# EAGLE schematic lfsensor (EAGLE 6.2)
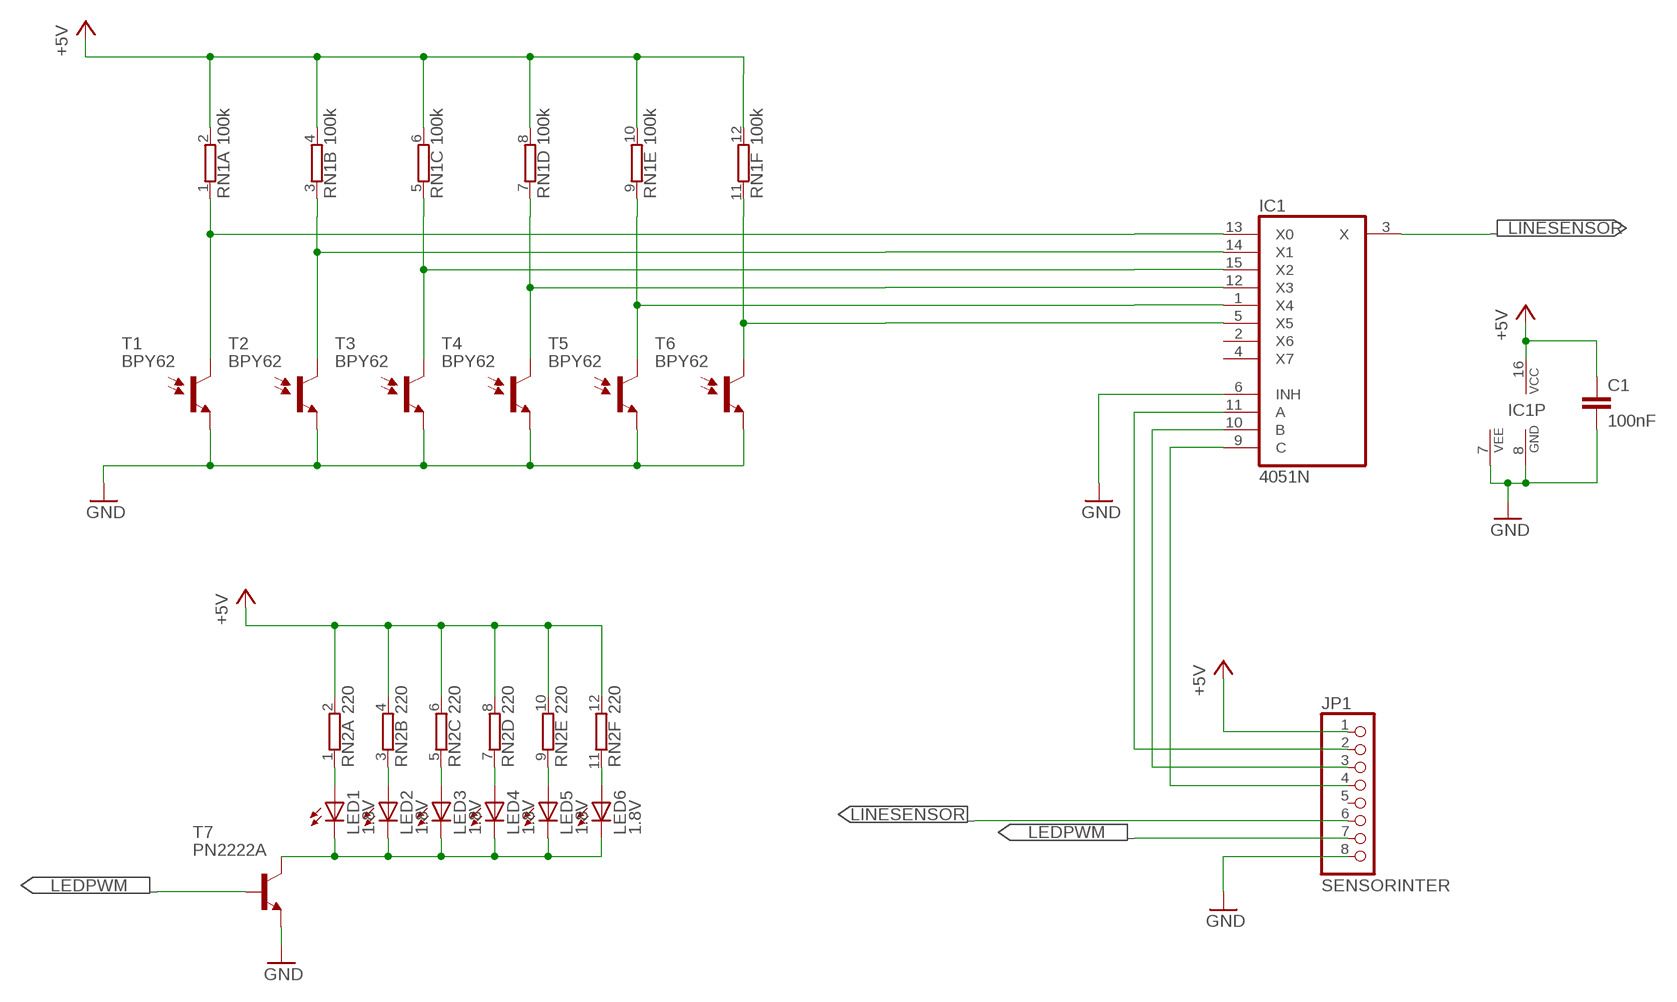
[diagram p0: schematic, sheet 1]

## Parts
C1  100nF  C-EU050-024X044  [C050-024X044]
IC1  4051N  [DIL16]
JP1  SENSORINTER  PINHD-1X8  [1X08]
LED1  1.8V  LED5MM  [LED5MM]
LED2  1.8V  LED5MM  [LED5MM]
LED3  1.8V  LED5MM  [LED5MM]
LED4  1.8V  LED5MM  [LED5MM]
LED5  1.8V  LED5MM  [LED5MM]
LED6  1.8V  LED5MM  [LED5MM]
RN1  100k  E6R  [SIL12]
RN2  220  E6R  [SIL12]
T1  BPY62  [TO18]
T2  BPY62  [TO18]
T3  BPY62  [TO18]
T4  BPY62  [TO18]
T5  BPY62  [TO18]
T6  BPY62  [TO18]
T7  PN2222A  [TO92]

## Nets
+5V: C1.1 IC1.16(VCC) JP1.1 RN1.2 RN1.4 RN1.6 RN1.8 RN1.10 RN1.12 RN2.2 RN2.4 RN2.6 RN2.8 RN2.10 RN2.12
GND: C1.2 IC1.6(INH) IC1.7(VEE) IC1.8(GND) JP1.8 T1.1(E) T2.1(E) T3.1(E) T4.1(E) T5.1(E) T6.1(E) T7.3(E)
LEDPWM: JP1.7 T7.2(B)
LINESENSOR: IC1.3(X) JP1.6
N$1: IC1.13(X0) RN1.1 T1.2(C)
N$2: IC1.14(X1) RN1.3 T2.2(C)
N$3: IC1.15(X2) RN1.5 T3.2(C)
N$4: IC1.12(X3) RN1.7 T4.2(C)
N$5: IC1.1(X4) RN1.9 T5.2(C)
N$6: IC1.5(X5) RN1.11 T6.2(C)
N$7: LED1.A RN2.1
N$8: LED2.A RN2.3
N$9: LED3.A RN2.5
N$10: LED4.A RN2.7
N$11: LED5.A RN2.9
N$12: LED6.A RN2.11
N$13: LED1.K(C) LED2.K(C) LED3.K(C) LED4.K(C) LED5.K(C) LED6.K(C) T7.1(C)
N$14: IC1.9(C) JP1.4
N$15: IC1.10(B) JP1.3
N$16: IC1.11(A) JP1.2
Unconnected: IC1.2(X6) IC1.4(X7) JP1.5

## Library data of the parts
C1 = resistor:C-EU: CAPACITOR, European symbol
IC1 = 40xx:4051: 8-channel ANALOG MULTIPLEXER
JP1 = pinhead:PINHD-1X8: PIN HEADER
LED1-LED6 = led:LED: LED OSRAM: - CHIPLED LG R971, LG N971, LY N971, LG Q971, LY Q971, LO R971, LY R971 LH N974, LH R974 LS Q976, LO Q976, LY Q976 LO Q996 - Hyper CHIPLED LW Q18S LB Q993, LB Q99A, LB R99A - SideLED LS A670, LO A670, LY A670, LG A670, LP A670 LB A673, LV A673, LT A673, LW A673 LH A674 LY A675 LS A676, LA A676, LO A676, LY A676, LW A676 LS A679, LY A679, LG A679 - Hyper Micro SIDELED® LS Y876, LA Y876, LO Y876, LY Y876 LT Y87S - SmartLED LW L88C, LW L88S LB L89C, LB L89S, LG L890 LS L89K, LO L89K, LY L89K LS L896, LA L896, LO L896, LY L896 - TOPLED LS T670, LO T670, LY T670, LG T670, LP T670 LSG T670, LSP T670, LSY T670, LOP T670, LYG T670 LG T671, LOG T671, LSG T671 LB T673, LV T673, LT T673, LW T673 LH T674 LS T676, LA T676, LO T676, LY T676, LB T676, LH T676, LSB T676, LW T676 LB T67C, LV T67C, LT T67C, LS T67K, LO T67K, LY T67K, LW E67C LS E67B, LA E67B, LO E67B, LY E67B, LB E67C, LV E67C, LT E67C LW T67C LS T679, LY T679, LG T679 LS T770, LO T770, LY T770, LG T770, LP T770 LB T773, LV T773, LT T773, LW T773 LH T774 LS E675, LA E675, LY E675, LS T675 LS T776, LA T776, LO T776, LY T776, LB T776 LHGB T686 LT T68C, LB T68C - Hyper Mini TOPLED® LB M676 - Mini TOPLED Santana® LG M470 LS M47K, LO M47K, LY M47K Source: http://www.osram.convergy.de LUXEON: - LUMILED® LXK2-PW12-R00, LXK2-PW12-S00, LXK2-PW14-U00, LXK2-PW14-V00 LXK2-PM12-R00, LXK2-PM12-S00, LXK2-PM14-U00 LXK2-PE12-Q00, LXK2-PE12-R00, LXK2-PE12-S00, LXK2-PE14-T00, LXK2-PE14-U00 LXK2-PB12-K00, LXK2-PB12-L00, LXK2-PB12-M00, LXK2-PB14-N00, LXK2-PB14-P00, LXK2-PB14-Q00 LXK2-PR12-L00, LXK2-PR12-M00, LXK2-PR14-Q00, LXK2-PR14-R00 LXK2-PD12-Q00, LXK2-PD12-R00, LXK2-PD12-S00 LXK2-PH12-R00, LXK2-PH12-S00 LXK2-PL12-P00, LXK2-PL12-Q00, LXK2-PL12-R00 Source: www.luxeon.com KINGBRIGHT: KA-3528ASYC Source: www.kingbright.com
RN1 RN2 = resistor-sil:E6R: SIL RESISTOR; OC_FARNELL: unknown; OC_NEWARK: unknown
T1-T6 = transistor:BPY62: NPN Phototransistor
T7 = 0mylib:PN2222A: NPN General Purpose Amplifier - This device is for use as a medium power amplifier and switch requiring collector currents up to 500mA.